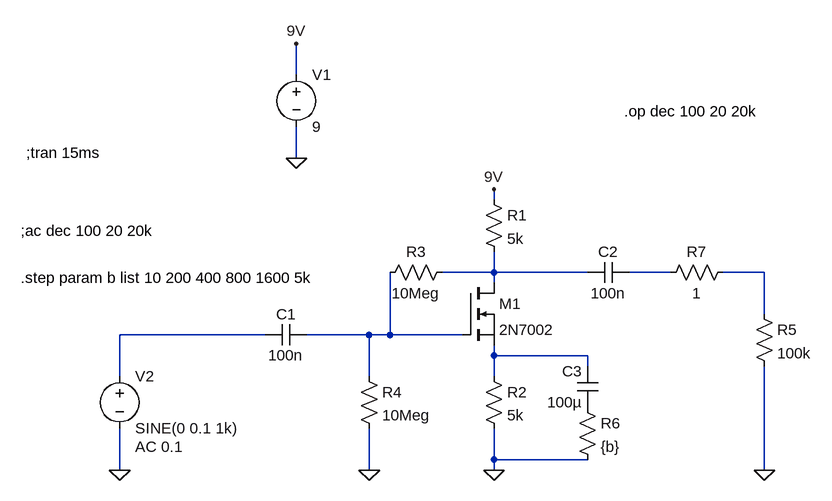
[diagram p0: schematic MOSFET_Single_Stage.asc]
MOSFET_Single_Stage.asc, the LTspice schematic file:
Version 4
SHEET 1 880 680
WIRE -128 -224 -128 -272
WIRE -128 -96 -128 -144
WIRE 176 -32 176 -48
WIRE 176 80 176 48
WIRE 176 80 96 80
WIRE 320 80 176 80
WIRE 448 80 384 80
WIRE 592 80 528 80
WIRE 176 96 176 80
WIRE 592 144 592 80
WIRE -176 176 -400 176
WIRE -16 176 -112 176
WIRE 16 176 16 80
WIRE 16 176 -16 176
WIRE 128 176 16 176
WIRE 176 208 176 192
WIRE 320 208 176 208
WIRE 320 224 320 208
WIRE -400 240 -400 176
WIRE -16 240 -16 176
WIRE 176 240 176 208
WIRE 176 368 176 320
WIRE 320 368 176 368
WIRE -400 384 -400 320
WIRE -16 384 -16 320
WIRE 176 384 176 368
WIRE 592 384 592 224
FLAG -128 -96 0
FLAG -128 -272 9V
FLAG -400 384 0
FLAG -16 384 0
FLAG 176 384 0
FLAG 592 384 0
FLAG 176 -48 9V
SYMBOL nmos 128 96 R0
SYMATTR InstName M1
SYMATTR Value 2N7002
SYMBOL voltage -128 -240 R0
WINDOW 123 0 0 Left 2
WINDOW 39 0 0 Left 2
SYMATTR InstName V1
SYMATTR Value 9
SYMBOL voltage -400 224 R0
WINDOW 123 24 124 Left 2
WINDOW 39 0 0 Left 2
SYMATTR InstName V2
SYMATTR Value SINE(0 0.1 1k)
SYMATTR Value2 AC 0.1
SYMBOL res 160 -48 R0
SYMATTR InstName R1
SYMATTR Value 5k
SYMBOL res 160 224 R0
SYMATTR InstName R2
SYMATTR Value 5k
SYMBOL res 112 64 R90
WINDOW 0 0 56 VBottom 2
WINDOW 3 32 56 VTop 2
SYMATTR InstName R3
SYMATTR Value 10Meg
SYMBOL res -32 224 R0
SYMATTR InstName R4
SYMATTR Value 10Meg
SYMBOL cap -112 160 R90
WINDOW 0 0 32 VBottom 2
WINDOW 3 32 32 VTop 2
SYMATTR InstName C1
SYMATTR Value 100n
SYMBOL cap 384 64 R90
WINDOW 0 0 32 VBottom 2
WINDOW 3 32 32 VTop 2
SYMATTR InstName C2
SYMATTR Value 100n
SYMBOL res 576 128 R0
SYMATTR InstName R5
SYMATTR Value 100k
SYMBOL cap 336 288 R180
WINDOW 0 24 56 Left 2
WINDOW 3 24 8 Left 2
SYMATTR InstName C3
SYMATTR Value 100µ
SYMBOL res 304 272 R0
SYMATTR InstName R6
SYMATTR Value {b}
SYMBOL res 544 64 R90
WINDOW 0 0 56 VBottom 2
WINDOW 3 32 56 VTop 2
SYMATTR InstName R7
SYMATTR Value 1
TEXT -552 16 Left 2 !;ac dec 100 20 20k
TEXT -552 88 Left 2 !.step param b list 10 200 400 800 1600 5k
TEXT -544 -104 Left 2 !;tran 15ms
TEXT 376 -168 Left 2 !.op dec 100 20 20k

The netlist it stands for:
* MOSFET_Single_Stage.asc
M1 N001 N005 N006 N006 2N7002
V1 9V 0 9
V2 N004 0 SINE(0 0.1 1k) AC 0.1
R1 9V N001 5k
R2 N006 0 5k
R3 N001 N005 10Meg
R4 N005 0 10Meg
C1 N005 N004 100n
C2 N002 N001 100n
R5 N003 0 100k
C3 P001 N006 100µ
R6 P001 0 {b}
R7 N003 N002 1
.model NMOS NMOS
.model PMOS PMOS
.lib standard.mos
;ac dec 100 20 20k
.step param b list 10 200 400 800 1600 5k
;tran 15ms
.op dec 100 20 20k
.backanno
.end